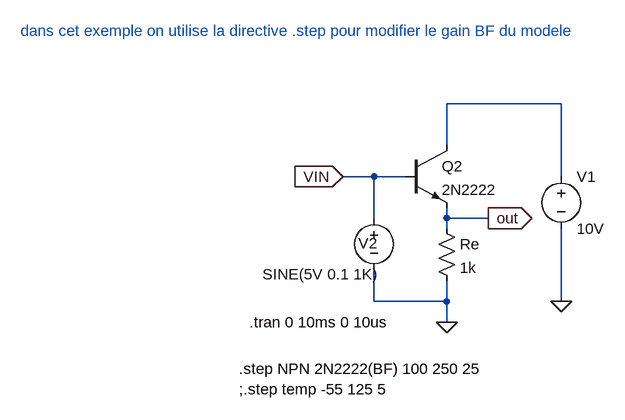
[diagram p0: schematic npn_collecteur.asc]
npn_collecteur.asc, the LTspice schematic file:
Version 4
SHEET 1 880 680
WIRE 384 112 208 112
WIRE 208 176 208 112
WIRE 96 224 48 224
WIRE 144 224 96 224
WIRE 384 224 384 112
WIRE 96 288 96 224
WIRE 208 288 208 272
WIRE 272 288 208 288
WIRE 208 304 208 288
WIRE 96 416 96 368
WIRE 208 416 208 384
WIRE 208 416 96 416
WIRE 384 416 384 304
WIRE 208 448 208 416
FLAG 384 416 0
FLAG 48 224 VIN
IOPIN 48 224 In
FLAG 272 288 out
IOPIN 272 288 Out
FLAG 208 448 0
SYMBOL voltage 384 208 R0
WINDOW 123 0 0 Left 0
WINDOW 39 0 0 Left 0
SYMATTR InstName V1
SYMATTR Value 10V
SYMBOL voltage 96 272 R0
WINDOW 3 -172 102 Left 0
WINDOW 123 0 0 Left 0
WINDOW 39 0 0 Left 0
WINDOW 0 -24 55 Left 0
SYMATTR Value SINE(5V 0.1 1K)
SYMATTR InstName V2
SYMBOL npn 144 176 R0
SYMATTR InstName Q2
SYMATTR Value 2N2222
SYMBOL res 192 288 R0
SYMATTR InstName Re
SYMATTR Value 1k
TEXT -96 448 Left 0 !.tran 0 10ms 0 10us
TEXT -112 520 Left 0 !.step NPN 2N2222(BF) 100 250 25\n;.step temp -55 125 5
TEXT -448 0 Left 0 ;dans cet exemple on utilise la directive .step pour modifier le gain BF du modele

The netlist it stands for:
* npn_collecteur.asc
V1 N001 0 10V
V2 VIN 0 SINE(5V 0.1 1K)
Q2 N001 VIN out 0 2N2222
Re out 0 1k
.model NPN NPN
.model PNP PNP
.lib standard.bjt
.tran 0 10ms 0 10us
.step NPN 2N2222(BF) 100 250 25
;.step temp -55 125 5
* dans cet exemple on utilise la directive .step pour modifier le gain BF du modele
.backanno
.end